# EAGLE design RaspberryPiSocket (EAGLE 7.3.0)
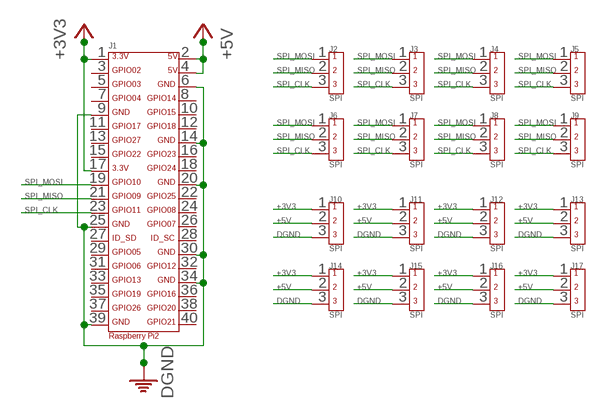
[diagram p0: schematic, sheet 1]

## Parts
J1  RPI2  [RPI2]
J2  SPI  CON_HEADER_3PIN_100  [CON_HEADER_3_100]
J3  SPI  CON_HEADER_3PIN_100  [CON_HEADER_3_100]
J4  SPI  CON_HEADER_3PIN_100  [CON_HEADER_3_100]
J5  SPI  CON_HEADER_3PIN_100  [CON_HEADER_3_100]
J6  SPI  CON_HEADER_3PIN_100  [CON_HEADER_3_100]
J7  SPI  CON_HEADER_3PIN_100  [CON_HEADER_3_100]
J8  SPI  CON_HEADER_3PIN_100  [CON_HEADER_3_100]
J9  SPI  CON_HEADER_3PIN_100  [CON_HEADER_3_100]
J10  SPI  CON_HEADER_3PIN_100  [CON_HEADER_3_100]
J11  SPI  CON_HEADER_3PIN_100  [CON_HEADER_3_100]
J12  SPI  CON_HEADER_3PIN_100  [CON_HEADER_3_100]
J13  SPI  CON_HEADER_3PIN_100  [CON_HEADER_3_100]
J14  SPI  CON_HEADER_3PIN_100  [CON_HEADER_3_100]
J15  SPI  CON_HEADER_3PIN_100  [CON_HEADER_3_100]
J16  SPI  CON_HEADER_3PIN_100  [CON_HEADER_3_100]
J17  SPI  CON_HEADER_3PIN_100  [CON_HEADER_3_100]

## Nets
+3V3: J1.1 J1.17 J10.1 J11.1 J12.1 J13.1 J14.1 J15.1 J16.1 J17.1
+5V: J1.2 J1.4 J10.2 J11.2 J12.2 J13.2 J14.2 J15.2 J16.2 J17.2
DGND: J1.6 J1.9 J1.14 J1.20 J1.25 J1.30 J1.34 J1.39 J10.3 J11.3 J12.3 J13.3 J14.3 J15.3 J16.3 J17.3
SPI_CLK: J1.23 J2.3 J3.3 J4.3 J5.3 J6.3 J7.3 J8.3 J9.3
SPI_MISO: J1.21 J2.2 J3.2 J4.2 J5.2 J6.2 J7.2 J8.2 J9.2
SPI_MOSI: J1.19 J2.1 J3.1 J4.1 J5.1 J6.1 J7.1 J8.1 J9.1
Unconnected: J1.3 J1.5 J1.7 J1.8 J1.10 J1.11 J1.12 J1.13 J1.15 J1.16 J1.18 J1.22 J1.24 J1.26 J1.27 J1.28 J1.29 J1.31 J1.32 J1.33 J1.35 J1.36 J1.37 J1.38 J1.40

## Library data of the parts
J1 = robot_lib:RPI2
J2-J17 = robot_lib:CON_HEADER_3PIN

## Board
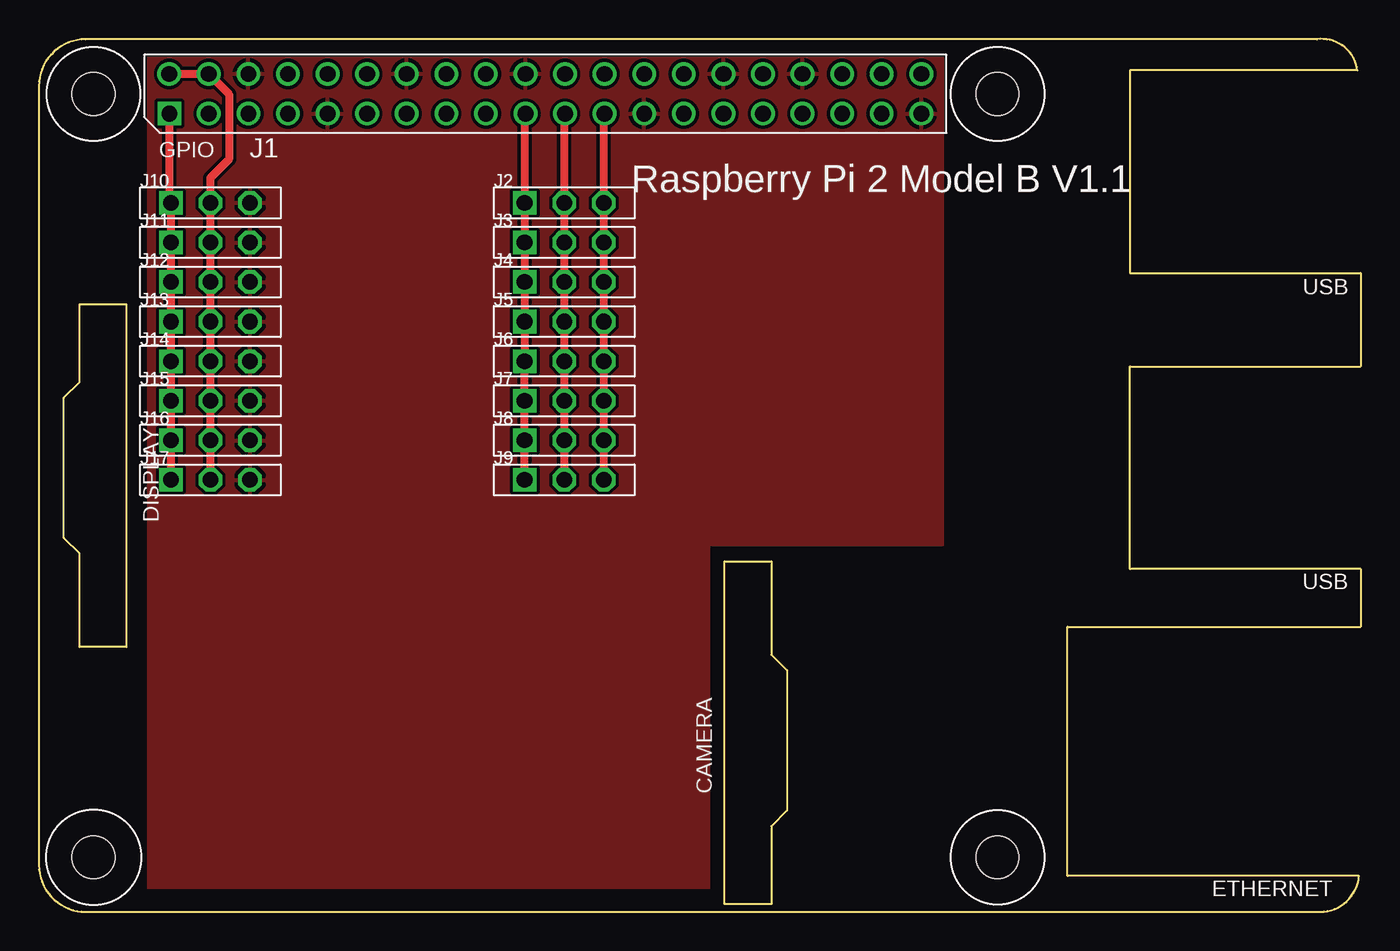
[diagram p1: board, top side]
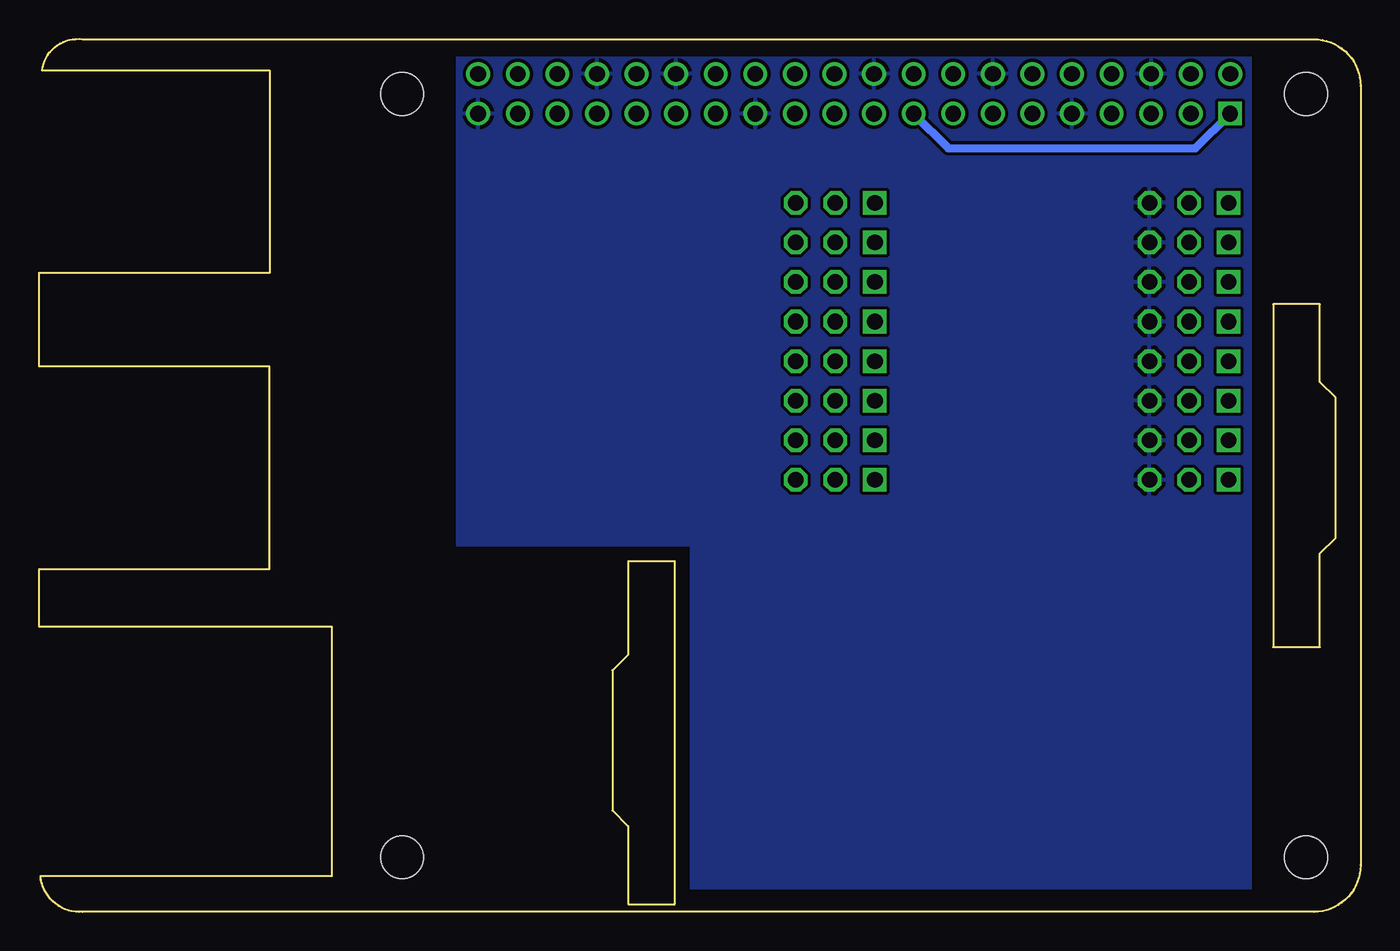
[diagram p2: board, bottom side, seen from below]

Size 84.8 x 56.03 mm. Coordinates in mm from the lower left corner, seen from the top.
Copper layers (1*16): Top 0.035mm / dielectric 1.5mm / Bottom 0.035mm
Design rules "default": minimum track width 10mil, minimum drill 24mil, track to track 8mil, track to pad 8mil, pad to pad 8mil, via to via 8mil, smd to smd 8mil, copper to edge 40mil, drill to drill 8mil, minimum pad ring 10mil, minimum via ring 8mil, stop-mask expansion 4mil, vias tented up to drill 0mil, thermal gap 10mil

### Footprints (pad centres in the part's own frame; a part is rotated, then mirrored left to right if it is on the bottom)
RPI2 = drill 1.016 square: 1 8.37,51.23 | drill 1.016: 2 8.357,53.772; 3 10.897,51.232; 4 10.897,53.772; 5 13.437,51.232; 6 13.437,53.772; 7 15.977,51.232; 8 15.977,53.772; 9 18.517,51.232; 10 18.517,53.772; 11 21.057,51.232; 12 21.057,53.772; 13 23.597,51.232; 14 23.597,53.772; 15 26.137,51.232; 16 26.137,53.772; 17 28.677,51.232; 18 28.677,53.772; 19 31.217,51.232; 20 31.217,53.772; 21 33.757,51.232; 22 33.757,53.772; 23 36.297,51.232; 24 36.297,53.772; 25 38.837,51.232; 26 38.837,53.772; 27 41.377,51.232; 28 41.377,53.772; 29 43.917,51.232; 30 43.917,53.772; 31 46.457,51.232; 32 46.457,53.772; 33 48.997,51.232; 34 48.997,53.772; 35 51.537,51.232; 36 51.537,53.772; 37 54.077,51.232; 38 54.077,53.772; 39 56.617,51.232; 40 56.617,53.772 | hole 2.75: 3.5,3.5; 61.5,3.5; 3.5,52.5; 61.5,52.5
CON_HEADER_3_100 = drill 1 square: 1 -2.54,0 | drill 1 octagon: 2 0,0; 3 2.54,0

### Placement (x,y rotation side)
J1  0,0.01 0 top
J2  33.7,45.51 0 top
J3  33.7,42.97 0 top
J4  33.7,40.43 0 top
J5  33.7,37.89 0 top
J6  33.7,35.35 0 top
J7  33.7,32.81 0 top
J8  33.7,30.27 0 top
J9  33.7,27.73 0 top
J10  11,45.51 0 top
J11  11,42.97 0 top
J12  11,40.43 0 top
J13  11,37.89 0 top
J14  11,35.35 0 top
J15  11,32.81 0 top
J16  11,30.27 0 top
J17  11,27.73 0 top

### Tracks (layer width: path | path; a pad name or v marks a point on that pad's centre or on a via)
+3V3
  Top 0.508: J1.1 8.37,45.6 J10.1 J11.1 J12.1 J13.1 J14.1 J15.1 J16.1 J17.1
  Bottom 0.508: J1.17 26.45,49.01 10.6,49.01 J1.1
+5V
  Top 0.508: J17.2 J16.2 J15.2 J14.2 J13.2 J12.2 J11.2 J10.2 11,47.11 12.2,48.31 12.2,52.48 J1.4 J1.2
DGND
  pour Top: 7,55.01 58,55.01 58,23.51 43,23.51 43,1.51 7,1.51
  pour Bottom: 7,55.01 58,55.01 58,23.51 43,23.51 43,1.51 7,1.51
SPI_CLK
  Top 0.508: J1.23 36.24,51.18 J2.3 J3.3 J4.3 J5.3 J6.3 J7.3 J8.3 J9.3
SPI_MISO
  Top 0.508: J1.21 33.7,51.18 J2.2 J3.2 J4.2 J5.2 J6.2 J7.2 J8.2 J9.2
SPI_MOSI
  Top 0.508: J1.19 31.16,51.18 J2.1 J3.1 J4.1 J5.1 J6.1 J7.1 J8.1 J9.1